# Altium project Drive_Circuit.PrjPcb
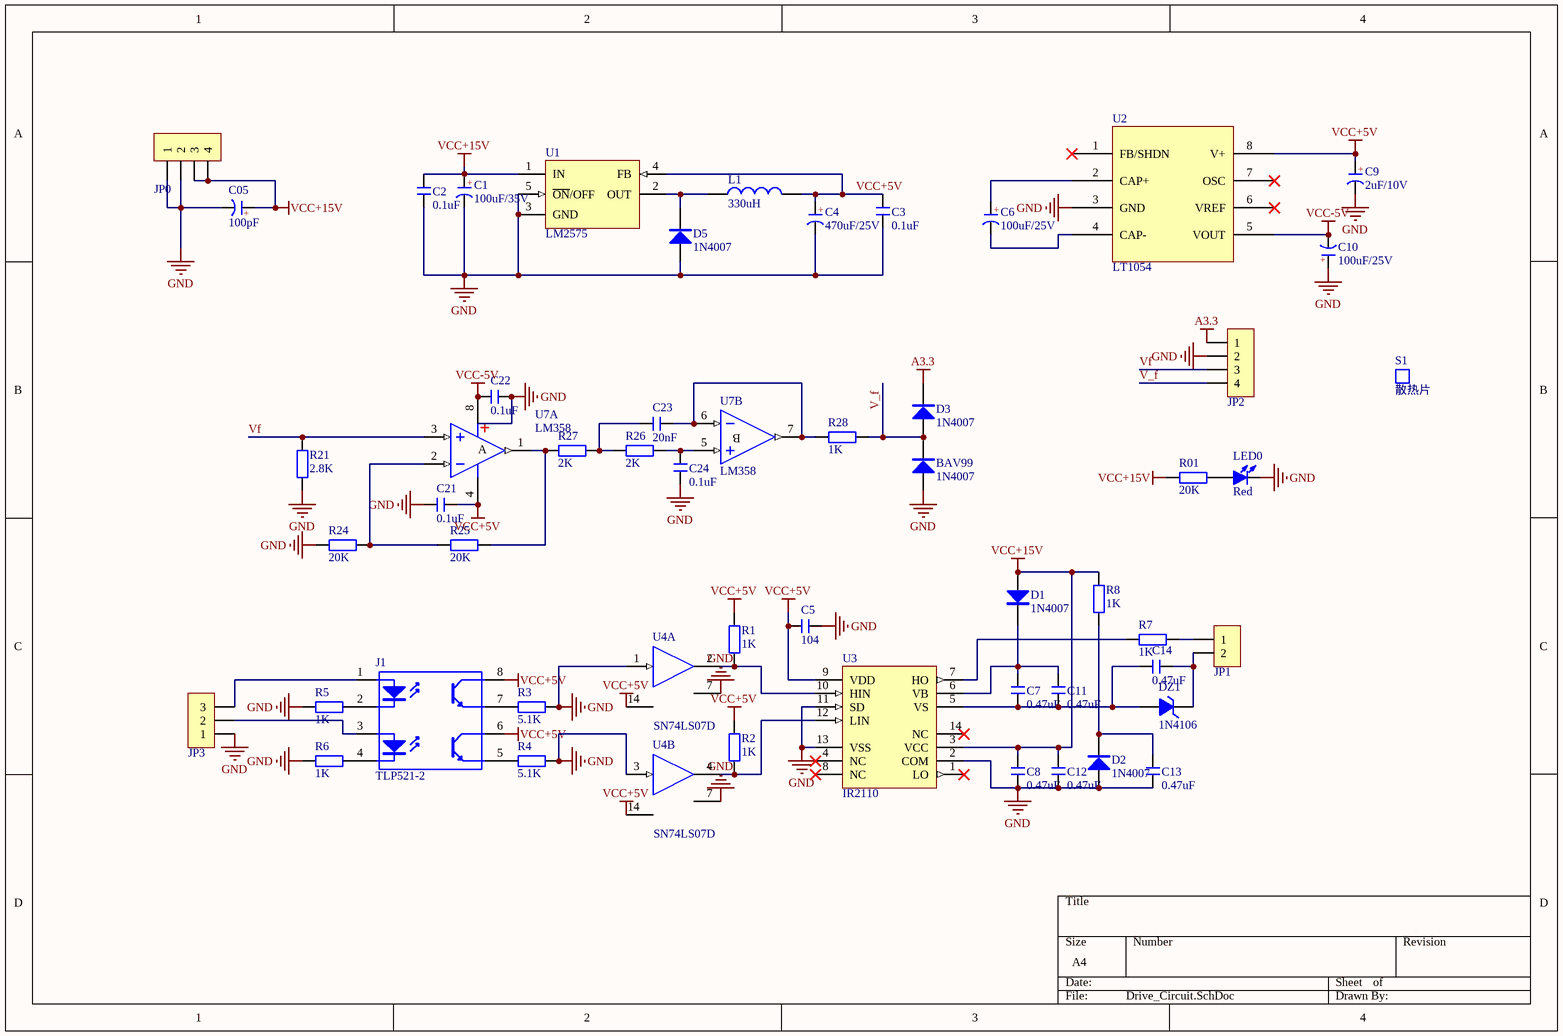
[diagram p0: Drive_Circuit.SchDoc]
1 sheet, 53 parts. Net scope: global (net labels, ports and power ports of the same name join across sheets).
Board file: Drive_Circuit.PcbDoc

## Sheet Drive_Circuit.SchDoc
size A4

### Parts
BAV99  1N4007  [DO-41]
C1  100uF/35V  [CAP 1.5*4*8]
C2  0.1uF  [C 0805]
C3  0.1uF  [C 0805]
C4  470uF/25V  [CAP 1.5*4*8]
C05  100pF  [CAP 1.5*4*8]
C5  104  [C 0805]
C6  100uF/25V  [CAP 1.5*4*8]
C7  0.47uF  [C 0805]
C8  0.47uF  [C 0805]
C9  2uF/10V  [CAP 1.5*4*8]
C10  100uF/25V  [CAP 1.5*4*8]
C11  0.47uF  [C 0805]
C12  0.47uF  [C 0805]
C13  0.47uF  [C 0805]
C14  0.47uF  [C 0805]
C21  0.1uF  [C 0805]
C22  0.1uF  [C 0805]
C23  20nF  [C 0805]
C24  0.1uF  [C 0805]
D1  1N4007  [DO-41]
D2  1N4007  [DO-41]
D3  1N4007  [DO-35]
D5  1N4007  [DO-35]
DZ1  1N4106  [DO-35]
J1  TLP521-2  [SOP8-W2.54_N]
JP0  HDR-1X4  [HDR-1X4]  (value not drawn)
JP1  HDR-1X2  [HDR-1X2]  (value not drawn)
JP2  HDR-1X4  [HDR-1X4]  (value not drawn)
JP3  HDR-1X3  [HDR-1X3]  (value not drawn)
L1  330uH  [L 0805]
LED0  Red  [LED 0805G]
R1  1K  [R 0805]
R01  20K  [R 0805]
R2  1K  [R 0805]
R3  5.1K  [R 0805]
R4  5.1K  [R 0805]
R5  1K  [R 0805]
R6  1K  [R 0805]
R7  1K  [R 0805]
R8  1K  [R 0805]
R21  2.8K  [R 0805]
R24  20K  [R 0805]
R25  20K  [R 0805]
R26  2K  [R 0805]
R27  2K  [R 0805]
R28  1K  [R 0805]
S1  散热片  [散热片]
U1  LM2575  [TO220-5B]
U2  LT1054  [DIP8-300]
U3  IR2110  [DIP14-300]
U4  SN74LS07D  [DIP14-300]  (parts A,B of 6)
U7  LM358  [SOP8_N]  (parts A,B of 2)

### Nets
A3.3: D3.2(K) JP2.1
GND: BAV99.1(A) C1.2(K) C2.1 C3.1 C4.2(K) C05.2(K) C5.2 C8.1 C9.2(K) C10.1(A) C12.1 C13.1 C21.1 C22.2 C24.1 D2.1(A) D5.1(A) JP0.1 JP0.2 JP2.2 JP3.1 LED0.2(K) R3.2 R4.2 R5.1 R6.1 R21.1 R24.2 U1.3(GND) U1.5(~{ON}/OFF) U2.3(GND) U3.2(COM) U3.11(SD) U3.13(VSS) U4.1(A) U4.3(A) U4.7(GND)
VCC+5V: C3.2 C4.1(A) C5.1 C9.1(A) C21.2 J1.6(2C) J1.8(1C) L1.2 R1.2 R2.2 U1.4(FB) U2.8(V+) U3.9(VDD) U4.14(VCC) U7.4(V-)  [also labelled VCC]
VCC+15V: C1.1(A) C2.2 C05.1(A) C8.2 C12.2 D1.1(A) JP0.3 JP0.4 R01.1 R8.2 U1.1(IN) U3.3(VCC)
VCC-5V: C10.2(K) C22.1 U2.5(VOUT) U7.8(V+)
V_f: BAV99.2(K) D3.1(A) JP2.4 R28.1
Vf: JP2.3 R21.2 U7.3(IN+)
NetC6_1: C6.1(A) U2.2(CAP+)
NetC6_2: C6.2(K) U2.4(CAP-)
NetC7_1: C7.1 C11.1 C14.2 DZ1.1(A) U3.5(VS)
NetC7_2: C7.2 C11.2 D1.2(K) U3.6(VB)
NetC13_2: C13.2 D2.2(K) R8.1
NetC14_1: C14.1 DZ1.2(K) JP1.2
NetC23_1: C23.1 R26.2 R27.1
NetC23_2: C23.2 R28.2 U7.6(IN-) U7.7(OUT)
NetC24_2: C24.2 R26.1 U7.5(IN+)
NetD5_2: D5.2(K) L1.1 U1.2(OUT)
NetJ1_1: J1.1(1A) JP3.3
NetJ1_2: J1.2(1K) R5.2
NetJ1_3: J1.3(2A) JP3.2
NetJ1_4: J1.4(2K) R6.2
NetJ1_5: J1.5(2E) R4.1
NetJ1_7: J1.7(1E) R3.1
NetJP1_1: JP1.1 R7.1
NetLED0_1: LED0.1(A) R01.2
NetR1_1: R1.1 U3.10(HIN) U4.2(Y)
NetR2_1: R2.1 U3.12(LIN) U4.4(Y)
NetR7_2: R7.2 U3.7(HO)
NetR24_1: R24.1 R25.2 U7.2(IN-)
NetR25_1: R25.1 R27.2 U7.1(OUT)

Not connected (* = marked no-connect by the designer): U2 1(FB/SHDN)* 6(VREF)* 7(OSC)*; U3 1(LO)* 4(NC)* 8(NC)* 14(NC)*

### Notes on the sheet
- (in symbol C-CAP) +
- (in symbol LM358, part A) A
- (in symbol LM358, part B) B

### Library data of the parts
BAV99 D1-D3 D5 = 1N4007: 整流二极管; 版权归属: 源创客; BOM名称: 整流二极管; 学习资源: www.ooocke.com
C1 C4 C05 C6 C9 C10 = C-CAP: 直插电解电容; 版权归属: 源创客; BOM名称: 直插电解电容; 学习资源: www.ooocke.com
C2 C3 C5 C7 C8 C11-C14 C21-C24 = C: 无极性贴片电容; 版权归属: 源创客; BOM名称: 无极性贴片电容; 学习资源: www.ooocke.com
DZ1 = 1N4106: 12V/0.5W稳压管; 版权归属: 源创客; BOM名称: 12V/0.5W稳压管; 学习资源: www.ooocke.com
J1 = TLP521-2: 2路开关光耦; 版权归属: 源创客; BOM名称: 2路开关光耦; 学习资源: www.ooocke.com
JP0 JP2 = Header 4: 4P接插件; 版权归属: 源创客; BOM名称: 4P接插件; 学习资源: www.ooocke.com
JP1 = Header 2: 2P接插件; 版权归属: 源创客; BOM名称: 2P接插件; 学习资源: www.ooocke.com
JP3 = Header 3: 3P接插件; 版权归属: 源创客; BOM名称: 3P接插件; 学习资源: www.ooocke.com
L1 = L: 小功率贴片电感; 版权归属: 源创客; BOM名称: 小功率贴片电感; 学习资源: www.ooocke.com
LED0 = LED-SMD: 贴片LED; 版权归属: 源创客; BOM名称: 贴片LED; 学习资源: www.ooocke.com
R1 R01-R8 R21 R24-R28 = R: 贴片电阻; 版权归属: 源创客; BOM名称: 贴片电阻; 学习资源: www.ooocke.com
S1 = S1: 版权归属: 源创客; BOM名称: 散热片; 学习资源: www.ooocke.com
U1 = LM2576: DC降压芯片; 版权归属: 源创客; BOM名称: DC降压芯片; 学习资源: www.ooocke.com
U3 = IR2110: High and Low Side Driver; Note: Pins 4, 8 and 14 are not connected; Published: 8-Jun-2000; LatestRevisionDate: 04-Mar-2005; LatestRevisionNote: Stylized 3D Model Added.; DatasheetVersion: PD60147J; PackageReference: PDIP14; Publisher: Altium Limited; PackageDescription: DIP; 14 Leads; Row Spacing 7.62 mm; Pitch 2.54 mm; ComponentLink1Description: Manufacturer Link; ComponentLink1URL: http://www.irf.com/; ComponentLink2Description: Datasheet; ComponentLink2URL: http://www.irf.com/product-info/datasheets/data/ir2110.pdf
U4 = SN74LS07D: Hex Buffer / Driver with Open-Collector High-Voltage Outputs; Published: 8-Jun-2000; LatestRevisionDate: 13-Apr-2006; LatestRevisionNote: IPC-7351 Footprint Added.; DatasheetVersion: Aug-1991; PackageVersion: Jan-1998; PackageReference: D014; Publisher: Altium Limited; PackageDescription: 14-Pin Small Outline Integrated Circuit 1.27 mm Pitch; Code_IPC: SOIC127P600-14; ComponentLink1Description: Manufacturer Link; ComponentLink1URL: http://www.ti.com/; ComponentLink2Description: Datasheet; ComponentLink2URL: http://www-s.ti.com/sc/ds/sn74ls07.pdf
U7 = LM358: 双路运放; 版权归属: 源创客; BOM名称: 双路运放; 学习资源: www.ooocke.com